# Altium schematic sheet OutputAmplifier.SchDoc
size A; SheetNumber: 4; SheetTotal: 4
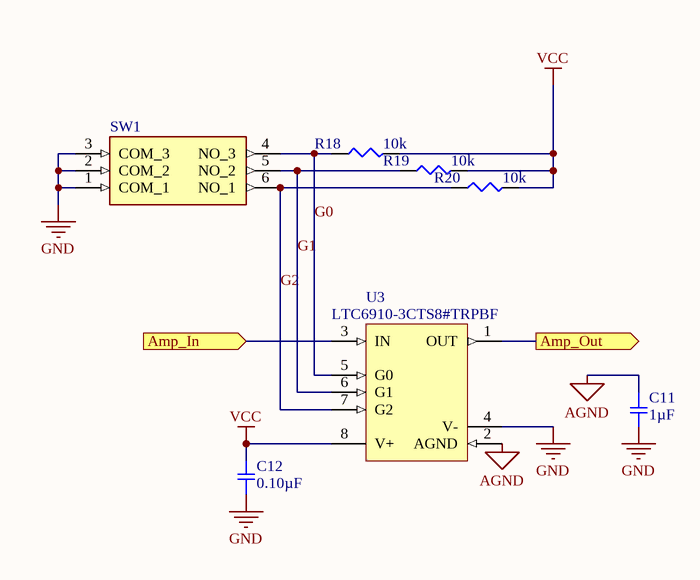
[diagram p0: OutputAmplifier.SchDoc]

## Parts
C11  1µF  [SMD-0603C]
C12  0.10µF  [SMD-0603C]
R18  10k  [SMD-0603-RES]
R19  10k  [SMD-0603-RES]
R20  10k  [SMD-0603-RES]
SW1  416131160803  [416131160803]  (value not drawn)
U3  LTC6910-3CTS8#TRPBF  [LT-TS8-8-TSOT-23_V]

## Ports
Amp_In (in), Amp_Out (out)

## Nets
AGND: C11.1 U3.2(AGND)
GND: C11.2 C12.1 SW1.1(COM_1) SW1.2(COM_2) SW1.3(COM_3) U3.4(V-)
VCC: C12.2 R18.2 R19.2 R20.2 U3.8(V+)
Amp_In: U3.3(IN) ; port Amp_In
Amp_Out: U3.1(OUT) ; port Amp_Out
G0: R18.1 SW1.4(NO_3) U3.5(G0)
G1: R19.1 SW1.5(NO_2) U3.6(G1)
G2: R20.1 SW1.6(NO_1) U3.7(G2)

## Library data of the parts
C11 = GCM188R71C105KA64D: CAP CER 1UF 16V X7R 0603; Manufacturer: Murata Electronics North America; Factory Stock: 0; Unit Price (USD): 0.24; Minimum Quantity: 1; Tolerance: ±10%; Datasheets: http://www.murata.com/~/media/webrenewal/support/library/catalog/products/capacitor/mlcc/c03e.ashx; Image: //media.digikey.com/Renders/Murata%20Renders/0603%28GCM188%29.jpg; Digi-Key Part Number: 490-5241-1-ND; Part Number: GCM188R71C105KA64D; Quantity Available: 9243; @ qty: 0; Packaging: Cut Tape (CT); Series: GCM; Part Status: Active; Value: 1µF; Voltage: 16V; Temperature Coefficient: X7R; Operating Temperature: -55°C ~ 125°C; Features: -; Ratings: AEC-Q200; Applications: Automotive; Mounting Type: Surface Mount, MLCC; Package / Case: 0603 (1608 Metric); Size / Dimension: 0.063" L x 0.031" W (1.60mm x 0.80mm); Height - Seated (Max): -; Thickness (Max): 0.035" (0.90mm); Lead Spacing: -; Lead Style: -
C12 = GCJ188R71C104KA01D: CAP CER 0.1UF 16V X7R 0603; Manufacturer: Murata Electronics North America; Factory Stock: 0; Unit Price (USD): 0.21; Minimum Quantity: 1; Tolerance: ±10%; Datasheets: http://www.murata.com/~/media/webrenewal/support/library/catalog/products/capacitor/mlcc/c03e.ashx; Image: //media.digikey.com/Renders/Murata%20Renders/0603%28LQG18%29.jpg; Digi-Key Part Number: 490-5796-1-ND; Part Number: GCJ188R71C104KA01D; Quantity Available: 22473; @ qty: 0; Packaging: Cut Tape (CT); Series: GCJ; Part Status: Active; Value: 0.10µF; Voltage: 16V; Temperature Coefficient: X7R; Operating Temperature: -55°C ~ 125°C; Features: Soft Termination; Ratings: AEC-Q200; Applications: Automotive, Boardflex Sensitive; Mounting Type: Surface Mount, MLCC; Package / Case: 0603 (1608 Metric); Size / Dimension: 0.063" L x 0.031" W (1.60mm x 0.80mm); Height - Seated (Max): -; Thickness (Max): 0.035" (0.90mm); Lead Spacing: -; Lead Style: -
R18-R20 = ERJ-3EKF1002V: RES SMD 10K OHM 1% 1/10W 0603; Manufacturer: Panasonic Electronic Components; Manufacturer Part Number: RNCP0603FTD10K0; Value: 10k; Operating Temperature: -55°C ~ 155°C; Package / Case: 0603 (1608 Metric); Datasheet Link: https://www.digikey.com/en/products/detail/stackpole-electronics-inc/RNCP0603FTD10K0/2240139
SW1 = 416131160803: Switch; Manufacturer_Name: Wurth Elektronik; Datasheet Link: https://www.we-online.com/catalog/datasheet/416131160803.pdf; Height: 2.65mm; Manufacturer_Part_Number: 416131160803; Mouser Part Number: 710-416131160803; Mouser Price/Stock: https://www.mouser.co.uk/ProductDetail/Wurth-Elektronik/416131160803?qs=2kOmHSv6VfS5Uv9iBh18ZA%3D%3D
U3 = CMP-0359-03721-2: Manufacturer: Analog Devices Inc.; Manufacturer Part Number: LTC6910-3CTS8#TRMPBF; RoHS: Pb-Free; Value: N/A; Operating Temperature: 0°C ~ 70°C; Datasheet Link: https://www.analog.com/media/en/technical-documentation/data-sheets/6910fb.pdf; Package / Case: TSOT-23-8